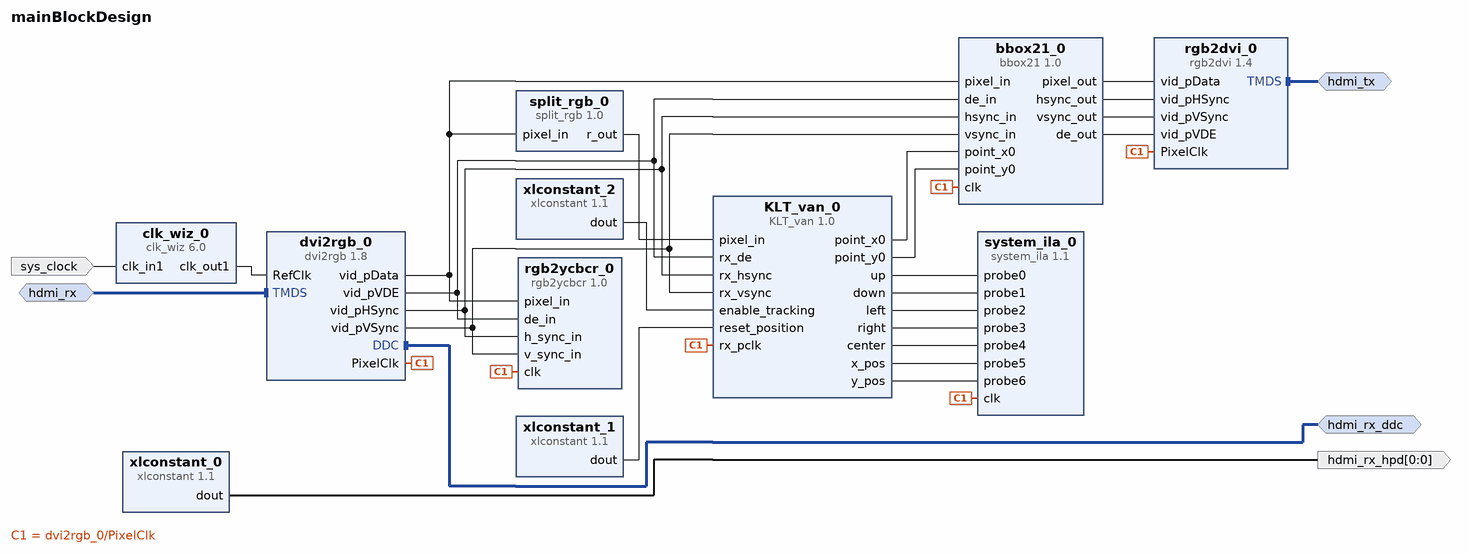
[diagram p0: block diagram of the top level]
# Vivado block design mainBlockDesign, xc7z020clg400-1, Vivado 2018.2
create_bd_design mainBlockDesign

create_bd_intf_port -mode Slave -vlnv digilentinc.com:interface:tmds_rtl:1.0 hdmi_rx
create_bd_intf_port -mode Master -vlnv digilentinc.com:interface:tmds_rtl:1.0 hdmi_tx
create_bd_intf_port -mode Master -vlnv xilinx.com:interface:iic_rtl:1.0 hdmi_rx_ddc
create_bd_port -dir O -from 0 -to 0 hdmi_rx_hpd
create_bd_port -dir I -type clk sys_clock
set_property -dict {CONFIG.FREQ_HZ 125000000 CONFIG.PHASE 0.000} [get_bd_ports sys_clock]

create_bd_cell -type ip -vlnv digilentinc.com:ip:dvi2rgb:1.8 dvi2rgb_0
set_property -dict [list \
  CONFIG.kEmulateDDC true \
  CONFIG.kEnableSerialClkOutput false \
  CONFIG.kRstActiveHigh true \
  CONFIG.kClkRange 1 \
  CONFIG.kEdidFileName dgl_1080p_cea.data \
] [get_bd_cells dvi2rgb_0]
create_bd_cell -type ip -vlnv xilinx.com:ip:clk_wiz:6.0 clk_wiz_0
set_property -dict [list \
  CONFIG.PRIMITIVE PLL \
  CONFIG.PRIM_IN_FREQ 125.000 \
  CONFIG.CLKIN1_JITTER_PS 80.0 \
  CONFIG.CLKOUT1_REQUESTED_OUT_FREQ 200 \
  CONFIG.CLKOUT1_DRIVES BUFG \
  CONFIG.CLKOUT2_DRIVES BUFG \
  CONFIG.CLKOUT3_DRIVES BUFG \
  CONFIG.CLKOUT4_DRIVES BUFG \
  CONFIG.CLKOUT5_DRIVES BUFG \
  CONFIG.CLKOUT6_DRIVES BUFG \
  CONFIG.CLKOUT7_DRIVES BUFG \
  CONFIG.FEEDBACK_SOURCE FDBK_AUTO \
  CONFIG.USE_LOCKED false \
  CONFIG.USE_RESET false \
  CONFIG.MMCM_DIVCLK_DIVIDE 1 \
  CONFIG.MMCM_CLKFBOUT_MULT_F 8 \
  CONFIG.MMCM_CLKIN1_PERIOD 8.000 \
  CONFIG.MMCM_CLKIN2_PERIOD 10.0 \
  CONFIG.MMCM_COMPENSATION ZHOLD \
  CONFIG.MMCM_CLKOUT0_DIVIDE_F 5 \
  CONFIG.USE_BOARD_FLOW true \
  CONFIG.CLK_IN1_BOARD_INTERFACE sys_clock \
  CONFIG.CLKOUT1_JITTER 109.241 \
  CONFIG.CLKOUT1_PHASE_ERROR 96.948 \
] [get_bd_cells clk_wiz_0]
create_bd_cell -type ip -vlnv digilentinc.com:ip:rgb2dvi:1.4 rgb2dvi_0
set_property -dict {CONFIG.kRstActiveHigh true CONFIG.kGenerateSerialClk true CONFIG.kClkRange 1} [get_bd_cells rgb2dvi_0]
create_bd_cell -type ip -vlnv xilinx.com:ip:xlconstant:1.1 xlconstant_0
create_bd_cell -type ip -vlnv ja:user:KLT_van:1.0 KLT_van_0
create_bd_cell -type ip -vlnv user.org:user:rgb2ycbcr:1.0 rgb2ycbcr_0
create_bd_cell -type ip -vlnv xilinx.com:ip:xlconstant:1.1 xlconstant_1
set_property -dict {CONFIG.CONST_VAL 0} [get_bd_cells xlconstant_1]
create_bd_cell -type ip -vlnv xilinx.com:ip:xlconstant:1.1 xlconstant_2
create_bd_cell -type ip -vlnv nsn-intra.net:user:bbox21:1.0 bbox21_0
create_bd_cell -type ip -vlnv xilinx.com:ip:system_ila:1.1 system_ila_0
set_property -dict {CONFIG.C_PROBE0_TYPE 0 CONFIG.C_NUM_OF_PROBES 7 CONFIG.C_MON_TYPE NATIVE} [get_bd_cells system_ila_0]
create_bd_cell -type ip -vlnv nsn-intra.net:user:split_rgb:1.0 split_rgb_0

# ---- connections ----

connect_bd_intf_net [get_bd_intf_ports hdmi_rx] [get_bd_intf_pins dvi2rgb_0/TMDS]
connect_bd_intf_net [get_bd_intf_ports hdmi_tx] [get_bd_intf_pins rgb2dvi_0/TMDS]
connect_bd_intf_net [get_bd_intf_ports hdmi_rx_ddc] [get_bd_intf_pins dvi2rgb_0/DDC]
connect_bd_net [get_bd_pins clk_wiz_0/clk_out1] [get_bd_pins dvi2rgb_0/RefClk]
connect_bd_net [get_bd_pins dvi2rgb_0/PixelClk] \
  [get_bd_pins rgb2dvi_0/PixelClk] [get_bd_pins rgb2ycbcr_0/clk] [get_bd_pins KLT_van_0/rx_pclk] [get_bd_pins bbox21_0/clk] \
  [get_bd_pins system_ila_0/clk]
connect_bd_net [get_bd_pins xlconstant_0/dout] [get_bd_ports hdmi_rx_hpd]
connect_bd_net [get_bd_ports sys_clock] [get_bd_pins clk_wiz_0/clk_in1]
connect_bd_net [get_bd_pins dvi2rgb_0/vid_pVDE] [get_bd_pins rgb2ycbcr_0/de_in] [get_bd_pins bbox21_0/de_in] [get_bd_pins KLT_van_0/rx_de]
connect_bd_net [get_bd_pins dvi2rgb_0/vid_pHSync] [get_bd_pins rgb2ycbcr_0/h_sync_in] [get_bd_pins bbox21_0/hsync_in] [get_bd_pins KLT_van_0/rx_hsync]
connect_bd_net [get_bd_pins dvi2rgb_0/vid_pVSync] [get_bd_pins rgb2ycbcr_0/v_sync_in] [get_bd_pins bbox21_0/vsync_in] [get_bd_pins KLT_van_0/rx_vsync]
connect_bd_net [get_bd_pins dvi2rgb_0/vid_pData] [get_bd_pins rgb2ycbcr_0/pixel_in] [get_bd_pins bbox21_0/pixel_in] [get_bd_pins split_rgb_0/pixel_in]
connect_bd_net [get_bd_pins xlconstant_2/dout] [get_bd_pins KLT_van_0/enable_tracking]
connect_bd_net [get_bd_pins xlconstant_1/dout] [get_bd_pins KLT_van_0/reset_position]
connect_bd_net [get_bd_pins KLT_van_0/point_x0] [get_bd_pins bbox21_0/point_x0]
connect_bd_net [get_bd_pins KLT_van_0/point_y0] [get_bd_pins bbox21_0/point_y0]
connect_bd_net [get_bd_pins bbox21_0/pixel_out] [get_bd_pins rgb2dvi_0/vid_pData]
connect_bd_net [get_bd_pins bbox21_0/hsync_out] [get_bd_pins rgb2dvi_0/vid_pHSync]
connect_bd_net [get_bd_pins bbox21_0/vsync_out] [get_bd_pins rgb2dvi_0/vid_pVSync]
connect_bd_net [get_bd_pins bbox21_0/de_out] [get_bd_pins rgb2dvi_0/vid_pVDE]
connect_bd_net -net up [get_bd_pins KLT_van_0/up] [get_bd_pins system_ila_0/probe0]
connect_bd_net [get_bd_pins KLT_van_0/down] [get_bd_pins system_ila_0/probe1]
connect_bd_net [get_bd_pins KLT_van_0/left] [get_bd_pins system_ila_0/probe2]
connect_bd_net [get_bd_pins KLT_van_0/right] [get_bd_pins system_ila_0/probe3]
connect_bd_net [get_bd_pins KLT_van_0/center] [get_bd_pins system_ila_0/probe4]
connect_bd_net [get_bd_pins KLT_van_0/x_pos] [get_bd_pins system_ila_0/probe5]
connect_bd_net [get_bd_pins KLT_van_0/y_pos] [get_bd_pins system_ila_0/probe6]
connect_bd_net [get_bd_pins split_rgb_0/r_out] [get_bd_pins KLT_van_0/pixel_in]

validate_bd_design
save_bd_design
